# Altium schematic sheet Leds.SchDoc
size A4
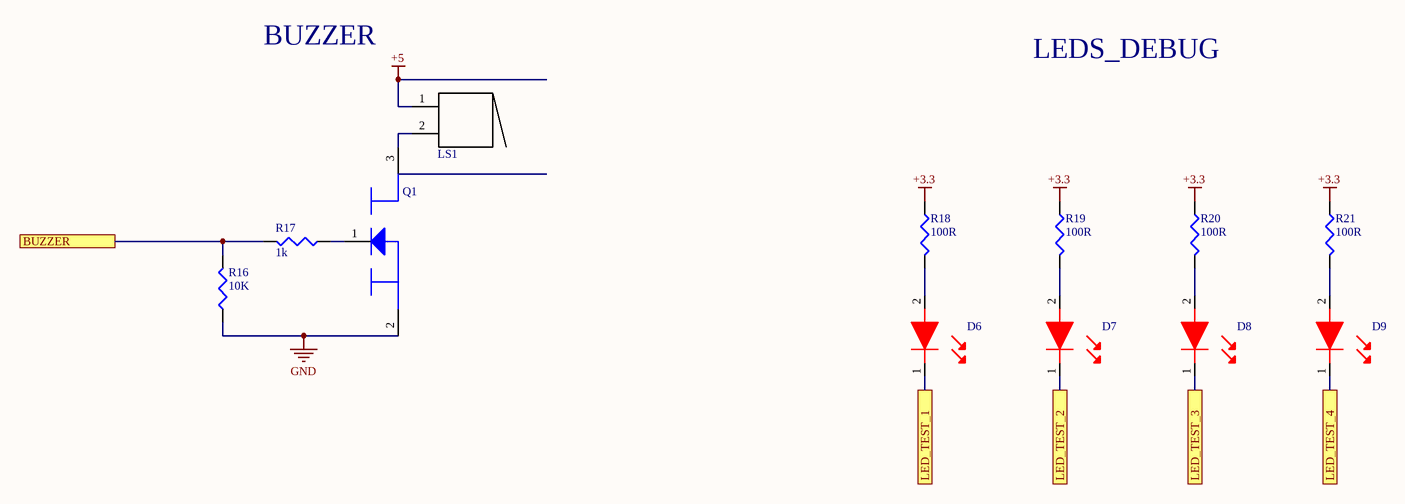
[diagram p0: Leds.SchDoc]

## Parts
D6  Standard LEDs - SMD  [Standard LEDs - SMD]  (value not drawn)
D7  Standard LEDs - SMD  [Standard LEDs - SMD]  (value not drawn)
D8  Standard LEDs - SMD  [Standard LEDs - SMD]  (value not drawn)
D9  Standard LEDs - SMD  [Standard LEDs - SMD]  (value not drawn)
LS1  Buzzers  [Buzzer]  (value not drawn)
Q1  MOSFET  [SOT96P240X110-3N]  (value not drawn)
R16  10K  [6-0805_M]
R17  1k  [6-0805_M]
R18  100R  [0603]
R19  100R  [0603]
R20  100R  [0603]
R21  100R  [0603]

## Ports
BUZZER, LED_TEST_1, LED_TEST_2, LED_TEST_3, LED_TEST_4

## Nets
+3.3: R18.1 R19.1 R20.1 R21.1
+5: LS1.1
GND: Q1.2 R16.1
BUZZER: R16.2 R17.2 ; port BUZZER
LED_TEST_1: D6.1 ; port LED_TEST_1
LED_TEST_2: D7.1 ; port LED_TEST_2
LED_TEST_3: D8.1 ; port LED_TEST_3
LED_TEST_4: D9.1 ; port LED_TEST_4
NetD6_2: D6.2 R18.2
NetD7_2: D7.2 R19.2
NetD8_2: D8.2 R20.2
NetD9_2: D9.2 R21.2
NetLS1_2: LS1.2 Q1.3
NetQ1_1: Q1.1 R17.1

## Notes on the sheet
- BUZZER
- LEDS_DEBUG

## Library data of the parts
D6-D9 = Standard LEDs - SMD: WURTH ELEKTRONIK - 150060RS75000 - LED, 0603, RED, 250MCD, 625NM; Manufacturer: Wurth Electronics; Viewing Angle: 140°; Lens Style: Clear,Rectangular; Forward Current: 30mA; Forward Voltage: 2V; Test Current: 20mA; Supplier 1: Mouser; Manufacturer Part Number: 150060RS75000; Stock 1: 77279; Pricing 1: 1=0.14, 10=0.138, 50=0.129, 100=0.11, 1000=0.095, 10000=0.095 (USD); Mount: Surface Mount; Case/Package: 0603; Color: Red; Case Code (Metric): 1608; Case Code (Imperial): 0603; Min Operating Temperature: -40°C; Max Operating Temperature: 85°C; Package Quantity: 1; Packaging: Cut Tape; Luminous Intensity: 250mcd; Wavelength: 625nm; Dominant Wavelength: 625nm; Length: 1.6mm; Height: 0.7mm; Width: 0.8mm; REACH SVHC: Unknown; ComponentLink1URL: https://katalog.we-online.de/led/datasheet/150060RS75000.pdf?src-supplier=Digi-Key; ComponentLink1Description: https://katalog.we-online.de/led/datasheet/150060RS75000.pdf?src-supplier=Digi-Key; ComponentLink2URL: http://www.produktinfo.conrad.com/datenblaetter/750000-774999/759428-da-01-en-CHIPLED_0603_W_KL_ROT_150060RS75000.pdf?src-supplier=Conrad; ComponentLink2Description: http://www.produktinfo.conrad.com/datenblaetter/750000-774999/759428-da-01-en-CHIPLED_0603_W_KL_ROT_150060RS75000.pdf?src-supplier=Conrad; Supplier Part Number 1: 710-150060RS75000; Category: Standard LEDs - SMD
LS1 = Buzzers: Audio 1.1Vp-p 3Vp-p 30mA 1.5Vp-p 85dBA 2400Hz to 2800Hz Through Hole Pin Bulk; Manufacturer: Mallory Sonalert; Manufacturer Part Number: PB-1226PEAQ; Shape: Round; Frequency: 2.6kHz; Operating Supply Voltage: 3V; Sensing Method: Magnetic; Washable: No; Supplier 1: Mouser; Stock 1: 5737; Pricing 1: 1=0.83, 10=0.66, 25=0.6, 50=0.561, 100=0.522, 250=0.478, 500=0.445, 1000=0.415, 2500=0.373, 10000=0.373 (USD); Mount: Through Hole; Min Operating Temperature: -30°C; Max Operating Temperature: 70°C; Packaging: Bulk; Package Quantity: 1; Operating Supply Current: 30mA; Termination: PC Pins; Diameter: 12mm; Height: 9.7mm; Depth: 9.5mm; ComponentLink1URL: http://www.mallory-sonalert.com/specifications/PB-1226PEAQ.pdf?src-supplier=Mouser; ComponentLink1Description: http://www.mallory-sonalert.com/specifications/PB-1226PEAQ.pdf?src-supplier=Mouser; ComponentLink2URL: http://www.mallory-sonalert.com/Specifications/PB-1226PEAQ.pdf?src-supplier=Digi-Key; ComponentLink2Description: http://www.mallory-sonalert.com/Specifications/PB-1226PEAQ.pdf?src-supplier=Digi-Key; ComponentLink3URL: https://www.alliedelec.com/m/d/fa962c4a5e81773ad0a24e293c835384.pdf?src-supplier=Allied+Electronics; ComponentLink3Description: https://www.alliedelec.com/m/d/fa962c4a5e81773ad0a24e293c835384.pdf?src-supplier=Allied+Electronics; Supplier Part Number 1: 539-PB1226PEAQ; Category: Piezo Buzzers & Audio Indicators
Q1 = MOSFET: MOSFET N-CH 30V 6.2A SOT23; Manufacturer: Diodes; Manufacturer Part Number: DMN3023L-7; Rds On Max: 25mR; Input Capacitance: 873pF; Max Power Dissipation: 900mW; Supplier 1: Mouser; Stock 1: 65104; Pricing 1: 1=0.35, 10=0.271, 50=0.271, 100=0.147, 1000=0.11, 3000=0.095, 9000=0.089, 10000=0.089 (USD); Mount: Surface Mount; Case/Package: TO-236-3; Min Operating Temperature: -55°C; Max Operating Temperature: 150°C; Packaging: Tape and Reel; Drain to Source Voltage (Vdss): 30V; Continuous Drain Current (ID): 6.2A; ComponentLink1URL: https://www.diodes.com/assets/Datasheets/DMN3023L.pdf?src-supplier=Digi-Key; ComponentLink1Description: https://www.diodes.com/assets/Datasheets/DMN3023L.pdf?src-supplier=Digi-Key; ComponentLink2URL: http://www.farnell.com/datasheets/2814401.pdf?src-supplier=Newark; ComponentLink2Description: http://www.farnell.com/datasheets/2814401.pdf?src-supplier=Newark; ComponentLink3URL: http://www.mouser.com/ds/2/115/DMN3023L-959533.pdf?src-supplier=Mouser; ComponentLink3Description: http://www.mouser.com/ds/2/115/DMN3023L-959533.pdf?src-supplier=Mouser; Supplier Part Number 1: 621-DMN3023L-7; Category: MOSFET
R16 = Resistor 10k 0805: RES SMD 10K OHM 1% 1/8W 0805; Manufacturer: Vishay; Manufacturer Part Number: CRCW080510K0FKEA; Resistance: 10kR; Power Rating: 125mW; Voltage Rating: 150V; Temperature Coefficient: 100ppm/°C; Supplier 1: Mouser; Stock 1: 474662; Pricing 1: 1=0.1, 10=0.066, 50=0.066, 100=0.06, 1000=0.043, 10000=0.019 (USD); Case/Package: 0805; Weight: 0.000194oz; Case Code (Imperial): 0805; Case Code (Metric): 2012; Contact Plating: Tin; Min Operating Temperature: -55°C; Max Operating Temperature: 155°C; Tolerance: 1%; Packaging: Tape and Reel; Package Quantity: 5000; Composition: Thick Film; Military Standard: Not; Termination: SMD/SMT; Voltage Rating (DC): 150V; Length: 2mm; Height: 0.45mm; Width: 1.25mm; Depth: 1.25mm; Radiation Hardening: No; REACH SVHC: Unknown; Lead Free: Lead Free; ComponentLink1URL: http://www.mouser.com/ds/2/427/dcrcwe3-109170.pdf?src-supplier=Mouser; ComponentLink1Description: http://www.mouser.com/ds/2/427/dcrcwe3-109170.pdf?src-supplier=Mouser; ComponentLink2URL: http://uk.rs-online.com/webdocs/0d98/0900766b80d98b26.pdf?src-supplier=RSComponents; ComponentLink2Description: http://uk.rs-online.com/webdocs/0d98/0900766b80d98b26.pdf?src-supplier=RSComponents; ComponentLink3URL: http://www.alliedelec.com/m/d/0c934d6939ccefa68dbe0b96d821c8cf.pdf?src-supplier=Allied+Electronics; ComponentLink3Description: http://www.alliedelec.com/m/d/0c934d6939ccefa68dbe0b96d821c8cf.pdf?src-supplier=Allied+Electronics; ComponentLink4URL: http://www.vishay.com/docs/20035/dcrcwe3.pdf?src-supplier=Avnet+Asia; ComponentLink4Description: http://www.vishay.com/docs/20035/dcrcwe3.pdf?src-supplier=Avnet+Asia; ComponentLink5URL: http://www.vishay.com/docs/20035/dcrcwe3.pdf?src-supplier=Avnet+Europe; ComponentLink5Description: http://www.vishay.com/docs/20035/dcrcwe3.pdf?src-supplier=Avnet+Europe; ComponentLink6URL: http://www.vishay.com/docs/20035/dcrcwe3.pdf?src-supplier=Avnet; ComponentLink6Description: http://www.vishay.com/docs/20035/dcrcwe3.pdf?src-supplier=Avnet; ComponentLink7URL: http://www.farnell.com/datasheets/2310790.pdf?src-supplier=Element14; ComponentLink7Description: http://www.farnell.com/datasheets/2310790.pdf?src-supplier=Element14; ComponentLink8URL: http://www.vishay.com/docs/20035/dcrcwe3.pdf?src-supplier=Future+Electronics; ComponentLink8Description: http://www.vishay.com/docs/20035/dcrcwe3.pdf?src-supplier=Future+Electronics; Supplier Part Number 1: 71-CRCW0805-10K-E3; Category: Thick Film Resistors - SMD
R17 = Resistor 1K 0805: RES SMD 1K OHM 1% 1/8W 0805; Manufacturer: Vishay Dale; Manufacturer Part Number: CRCW08051K00FKEA; Voltage Rating: 150V; Power Rating: 125mW; Resistance: 1kR; Temperature Coefficient: 100ppm/°C; Supplier 1: Mouser; Stock 1: 338031; Pricing 1: 1=0.12, 10=0.06, 50=0.06, 100=0.034, 1000=0.02, 10000=0.01 (USD); Case/Package: 0805; Number of Pins: 2; Weight: 0.000194oz; Case Code (Imperial): 0805; Case Code (Metric): 2012; Contact Plating: Tin; Min Operating Temperature: -55°C; Max Operating Temperature: 155°C; Packaging: Tape and Reel; Package Quantity: 5000; Tolerance: 1%; Composition: Thick Film; Termination: SMD/SMT; Military Standard: Not; Voltage Rating (DC): 150V; Length: 2mm; Height: 0.45mm; Width: 1.25mm; Depth: 1.25mm; Radiation Hardening: No; REACH SVHC: Unknown; Lead Free: Lead Free; ComponentLink1URL: http://uk.rs-online.com/webdocs/0d98/0900766b80d98b26.pdf?src-supplier=RSComponents; ComponentLink1Description: http://uk.rs-online.com/webdocs/0d98/0900766b80d98b26.pdf?src-supplier=RSComponents; ComponentLink2URL: http://www.farnell.com/datasheets/2310790.pdf?src-supplier=Element14; ComponentLink2Description: http://www.farnell.com/datasheets/2310790.pdf?src-supplier=Element14; ComponentLink3URL: http://www.vishay.com/docs/20035/dcrcwe3.pdf?src-supplier=Avnet; ComponentLink3Description: http://www.vishay.com/docs/20035/dcrcwe3.pdf?src-supplier=Avnet; ComponentLink4URL: https://www.distrelec.biz/Web/Downloads/a_/en/flD-CRCW-e3_data_en.pdf?mime=application%2Fpdf&src-supplier=Distrelec; ComponentLink4Description: https://www.distrelec.biz/Web/Downloads/a_/en/flD-CRCW-e3_data_en.pdf?mime=application%2Fpdf&src-supplier=Distrelec; ComponentLink5URL: http://www.vishay.com/docs/20035/dcrcwe3.pdf?src-supplier=Future+Electronics; ComponentLink5Description: http://www.vishay.com/docs/20035/dcrcwe3.pdf?src-supplier=Future+Electronics; ComponentLink6URL: http://www.vishay.com/docs/20035/dcrcwe3.pdf?src-supplier=Avnet+Europe; ComponentLink6Description: http://www.vishay.com/docs/20035/dcrcwe3.pdf?src-supplier=Avnet+Europe; Supplier Part Number 1: 71-CRCW0805-1.0K-E3; Category: Thick Film Resistors - SMD
R18-R21 = Resistor 100 0603: RES SMD 100 OHM 1% 1/10W 0603; Manufacturer: Vishay Intertechnology; Manufacturer Part Number: CRCW0603100RFKEA; Power Rating: 100mW; Voltage Rating (DC): 75V; Temperature Coefficient: 100ppm/°C; Supplier 1: Mouser; Stock 1: 221485; Pricing 1: 1=0.1, 10=0.037, 50=0.037, 100=0.026, 1000=0.006, 10000=0.005 (USD); Case/Package: 0603; Number of Pins: 2; Packaging: Cut Tape; Resistance: 100R; Tolerance: 1%; Length: 1.55mm; Height: 450um; Width: 850um; REACH SVHC: No SVHC; Lead Free: Lead Free; Supplier Part Number 1: 71-CRCW0603-100-E3; Category: Thick Film Resistors - SMD